# EAGLE design AA version (EAGLE 9.2.2)
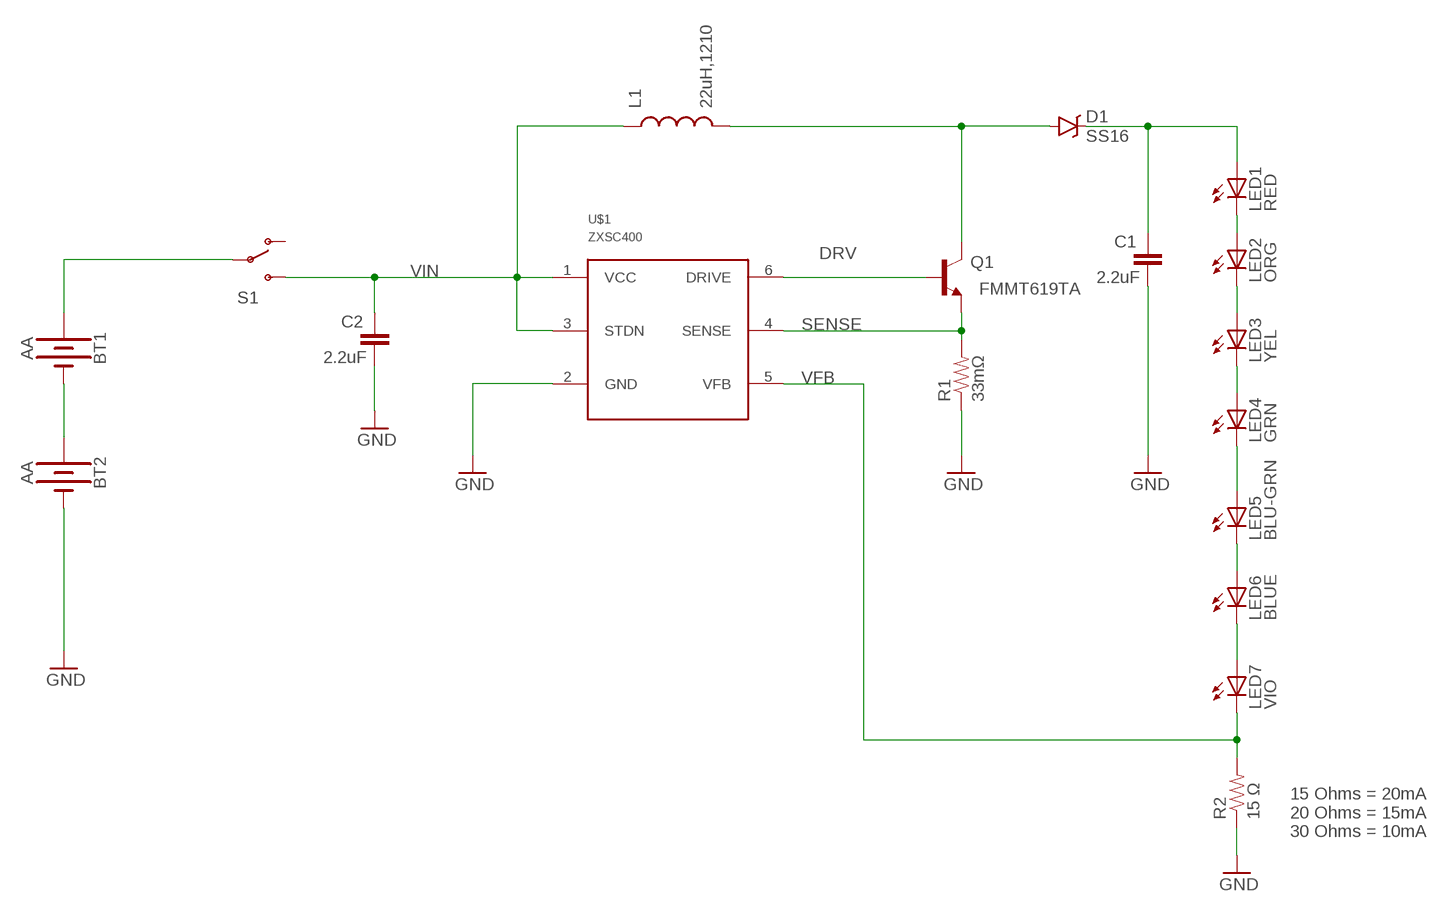
[diagram p0: schematic, sheet 1]

## Parts
BT1  AA  BATTERY-AA  [BATTERY-AA]
BT2  AA  BATTERY-AA  [BATTERY-AA]
C1  2.2uF  CAP1206  [1206]
C2  2.2uF  CAP1206  [1206]
D1  SS16  DIODE-SCHOTTKY-B340A  [SMA-DIODE]
L1  22uH,1210  INDUCTOR1210  [1210]
LED1  RED  LEDP-LCC-2  [P-LCC-2]
LED2  ORG  LEDP-LCC-2  [P-LCC-2]
LED3  YEL  LEDP-LCC-2  [P-LCC-2]
LED4  GRN  LEDP-LCC-2  [P-LCC-2]
LED5  BLU-GRN  LEDP-LCC-2  [P-LCC-2]
LED6  BLUE  LEDP-LCC-2  [P-LCC-2]
LED7  VIO  LEDP-LCC-2  [P-LCC-2]
Q1  FMMT619TA  TRANSISTOR_NPNSOT23-3  [SOT23-3]
R1  33mΩ  RESISTOR1206  [1206]
R2  15 Ω  RESISTOR1206  [1206]
S1  SWITCH-SPDTPTH_LOCK  [SWITCH-SPDT_LOCK.007S]
U$1  ZXSC400  [SOT23-6]

## Nets
DRV: Q1.1(B) U$1.6(DRIVE)
GND: BT2.GND@1(-) C1.1 C2.1 R1.1 R2.1 U$1.2(GND)
N$1: BT1.GND@1(-) BT2.PWR@1(+)
N$2: BT1.PWR@1(+) S1.2(P)
N$4: D1.A L1.2 Q1.3(C)
N$6: C1.2 D1.C LED1.A
N$8: LED1.C LED2.A
N$9: LED2.C LED3.A
N$10: LED3.C LED4.A
N$11: LED4.C LED5.A
N$12: LED5.C LED6.A
N$13: LED6.C LED7.A
SENSE: Q1.2(E) R1.2 U$1.4(SENSE)
VFB: LED7.C R2.2 U$1.5(VFB)
VIN: C2.2 L1.1 S1.3(S) U$1.1(VCC) U$1.3(STDN)
Unconnected: S1.1(O)

## Notes on the sheet
- 15 Ohms = 20mA
  20 Ohms = 15mA
  30 Ohms = 10mA

## Library data of the parts
BT1 BT2 = SparkFun-Batteries:BATTERY: Battery - Single Cell A variety of battery chemistries, sizes, and footprints. Device List: 20MM_PTH - Coin Cell Battery Holder - 20mm (PTH) <https://www.sparkfun.com/products/783> 6.8MM_PTH - Coin Cell Battery Holder - 6.8MM(SMD) <https://www.digikey.com/product-detail/en/seiko-instruments/MS621FE-FL11E/728-1057-ND/1889208?WT.srch=1&gclid=CNOQ5a6LzdQCFZS2wAodXCkE0g> 12MM_SMD - Coin Cell Battery Holder - 12mm (SMD) <https://www.sparkfun.com/products/10592> 12MM_PTH - Coin Cell Battery Holder - 12mm (PTH) <https://www.sparkfun.com/products/7948> 20MM_SMD - 20mm Coin Cell Battery Holder (SMD) (2 legs) Used on the Big Time Watch Kit <https://www.sparkfun.com/products/11734> 20MM_SMD_4LEGS - Coin Cell Battery Holder - 20mm (SMD) <https://www.sparkfun.com/products/11892> 20MM_SMD_4LEGS_OVERPASTE - Coin Cell Battery Holder - 20mm (SMD) <https://www.sparkfun.com/products/11892> (Over-paste on the legs) 24.5MM_PTH - Coin Cell Battery Holder - 24.5mm (PTH) <https://www.sparkfun.com/products/8863> 9V - 9V Battery Holder - PC Mount Used on the SparkFun SparkPunk Sound Kit <https://www.sparkfun.com/products/11177> and SparkFun SparkPunk Sequencer Kit <https://www.sparkfun.com/products/12707> 18650 - Battery Holder - 18650 (PTH) <https://www.sparkfun.com/products/13113> AA - Battery Holder - 1xAA (PTH) <https://www.sparkfun.com/products/7949> AAA - Battery Holder - 1xAAA (PTH) <https://www.sparkfun.com/products/12718> AA_KIT - Battery Holder - 1xAA (PTH) <https://www.sparkfun.com/products/7949> Special kit package - pads only have exposed copper on one side of the board. AAA_KIT - Battery Holder - 1xAAA (PTH) <https://www.sparkfun.com/products/12718> Special kit package - pads only have exposed copper on one side of the board.; PROD_ID: BATT-08316; SF_SKU: PRT-07949
C1 C2 = SparkFun-Passives:CAP: Capacitor Standard 0603 ceramic capacitor, and 0.1" leaded capacitor.
D1 = SparkFun-DiscreteSemi:DIODE-SCHOTTKY: Schottky diodes in SFE's production catalog BAT20J 1A 23V 0.62Vf RB751 120mA 40V 0.37Vf PMEG4005EJ 0.5A 40V 0.42Vf MBRA140 1A 40V 0.5Vf B340A 3A 40V SMA; PROD_ID: DIO-09886; VALUE: B340A
L1 = SparkFun-Passives:INDUCTOR: Inductors Basic Inductor/Choke - 0603 and 1206. Footprints are not proven and vary greatly between part numbers. SRN6045- 33uH, 20% 1.4A SDR0403-560KL - 56uH, 10%, 500mA RMS/740mA peak
LED1-LED7 = led:LED: LED OSRAM: - CHIPLED LG R971, LG N971, LY N971, LG Q971, LY Q971, LO R971, LY R971 LH N974, LH R974 LS Q976, LO Q976, LY Q976 LO Q996 - Hyper CHIPLED LW Q18S LB Q993, LB Q99A, LB R99A - SideLED LS A670, LO A670, LY A670, LG A670, LP A670 LB A673, LV A673, LT A673, LW A673 LH A674 LY A675 LS A676, LA A676, LO A676, LY A676, LW A676 LS A679, LY A679, LG A679 - Hyper Micro SIDELED® LS Y876, LA Y876, LO Y876, LY Y876 LT Y87S - SmartLED LW L88C, LW L88S LB L89C, LB L89S, LG L890 LS L89K, LO L89K, LY L89K LS L896, LA L896, LO L896, LY L896 - TOPLED LS T670, LO T670, LY T670, LG T670, LP T670 LSG T670, LSP T670, LSY T670, LOP T670, LYG T670 LG T671, LOG T671, LSG T671 LB T673, LV T673, LT T673, LW T673 LH T674 LS T676, LA T676, LO T676, LY T676, LB T676, LH T676, LSB T676, LW T676 LB T67C, LV T67C, LT T67C, LS T67K, LO T67K, LY T67K, LW E67C LS E67B, LA E67B, LO E67B, LY E67B, LB E67C, LV E67C, LT E67C LW T67C LS T679, LY T679, LG T679 LS T770, LO T770, LY T770, LG T770, LP T770 LB T773, LV T773, LT T773, LW T773 LH T774 LS E675, LA E675, LY E675, LS T675 LS T776, LA T776, LO T776, LY T776, LB T776 LHGB T686 LT T68C, LB T68C - Hyper Mini TOPLED® LB M676 - Mini TOPLED Santana® LG M470 LS M47K, LO M47K, LY M47K Source: http://www.osram.convergy.de LUXEON: - LUMILED® LXK2-PW12-R00, LXK2-PW12-S00, LXK2-PW14-U00, LXK2-PW14-V00 LXK2-PM12-R00, LXK2-PM12-S00, LXK2-PM14-U00 LXK2-PE12-Q00, LXK2-PE12-R00, LXK2-PE12-S00, LXK2-PE14-T00, LXK2-PE14-U00 LXK2-PB12-K00, LXK2-PB12-L00, LXK2-PB12-M00, LXK2-PB14-N00, LXK2-PB14-P00, LXK2-PB14-Q00 LXK2-PR12-L00, LXK2-PR12-M00, LXK2-PR14-Q00, LXK2-PR14-R00 LXK2-PD12-Q00, LXK2-PD12-R00, LXK2-PD12-S00 LXK2-PH12-R00, LXK2-PH12-S00 LXK2-PL12-P00, LXK2-PL12-Q00, LXK2-PL12-R00 Source: www.luxeon.com KINGBRIGHT: KA-3528ASYC Source: www.kingbright.com
Q1 = SparkFun-DiscreteSemi:TRANSISTOR_NPN: Generic NPN BJT MMBT2222A - TRANS-08049 (SOT-23, 1A 40V) MPSA42 - TRANS-09116 (SOT-23, 500mA 300V) MMBT5088LT1G - TRANS-11160 (SOT-23, 50 mA 30V) BC547 - COM-08928 <http://www.sparkfun.com/products/8928> (TO-92 45V 100mA) (1.Collector 2.Base 3.Emitter) 2N3904 - COM-00521 <http://www.sparkfun.com/products/521> (TO-92 40V 200mA) (1.Emitter 2.Base 3.Collector) P2N2222A - COM-12852 <http://www.sparkfun.com/products/12852> (TO-92 40V 600mA) (1.Collector 2.Base 3.Emitter)
R1 R2 = SparkFun-Passives:RESISTOR: Resistor Basic schematic elements and footprints for 0603, 1206, and PTH resistors.
S1 = SparkFun-Electromechanical:SWITCH-SPDT: SPDT Switch Simple slide switch, Spark Fun Electronics SKU : COM-00102 DPDT SMT slide switch, AYZ0202, SWCH-08179
U$1 = ZXSC400:ZXSC400

## Board
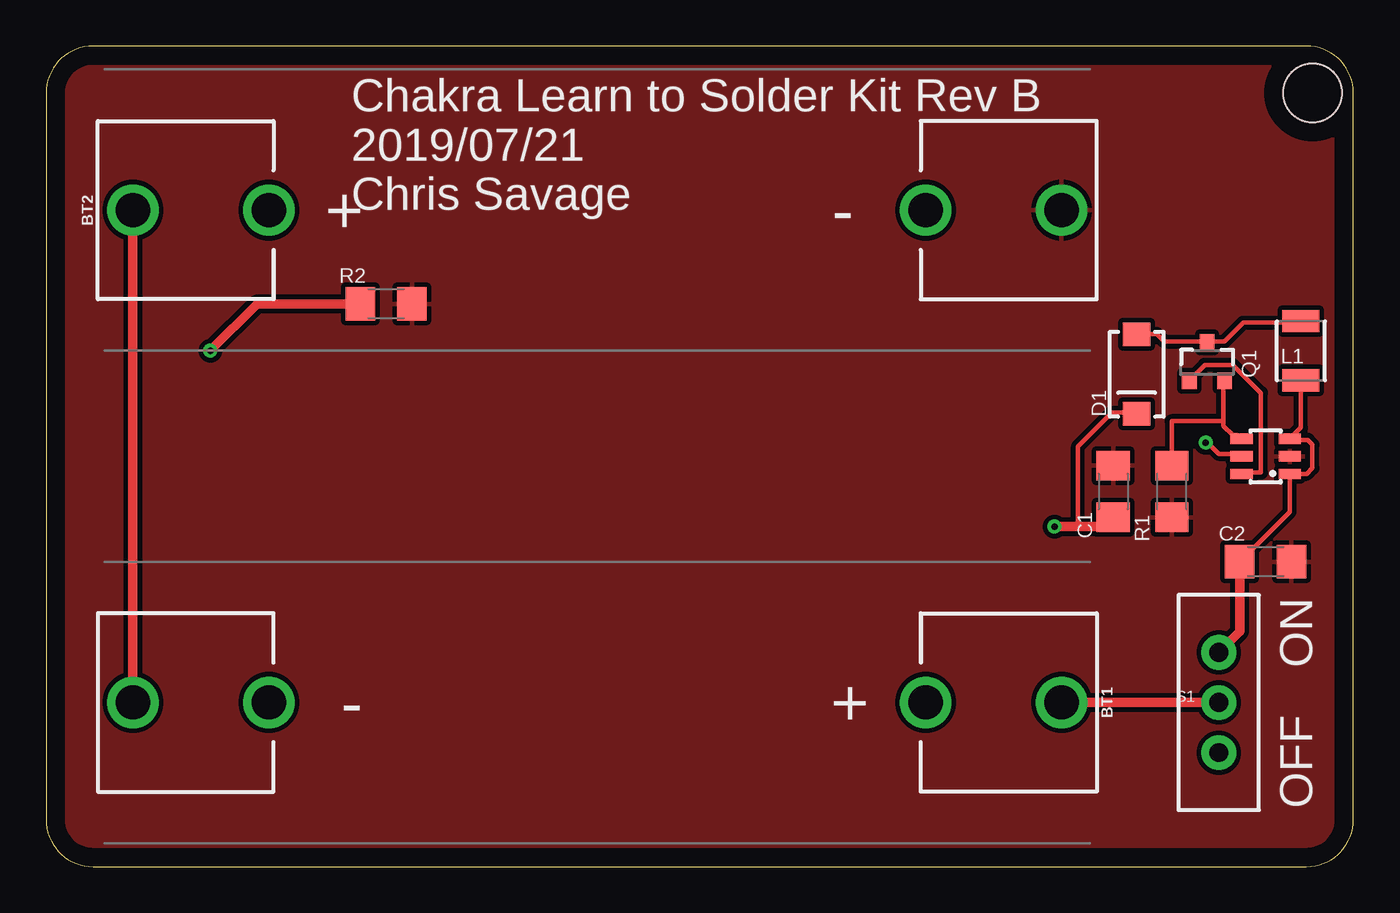
[diagram p1: board, top side]
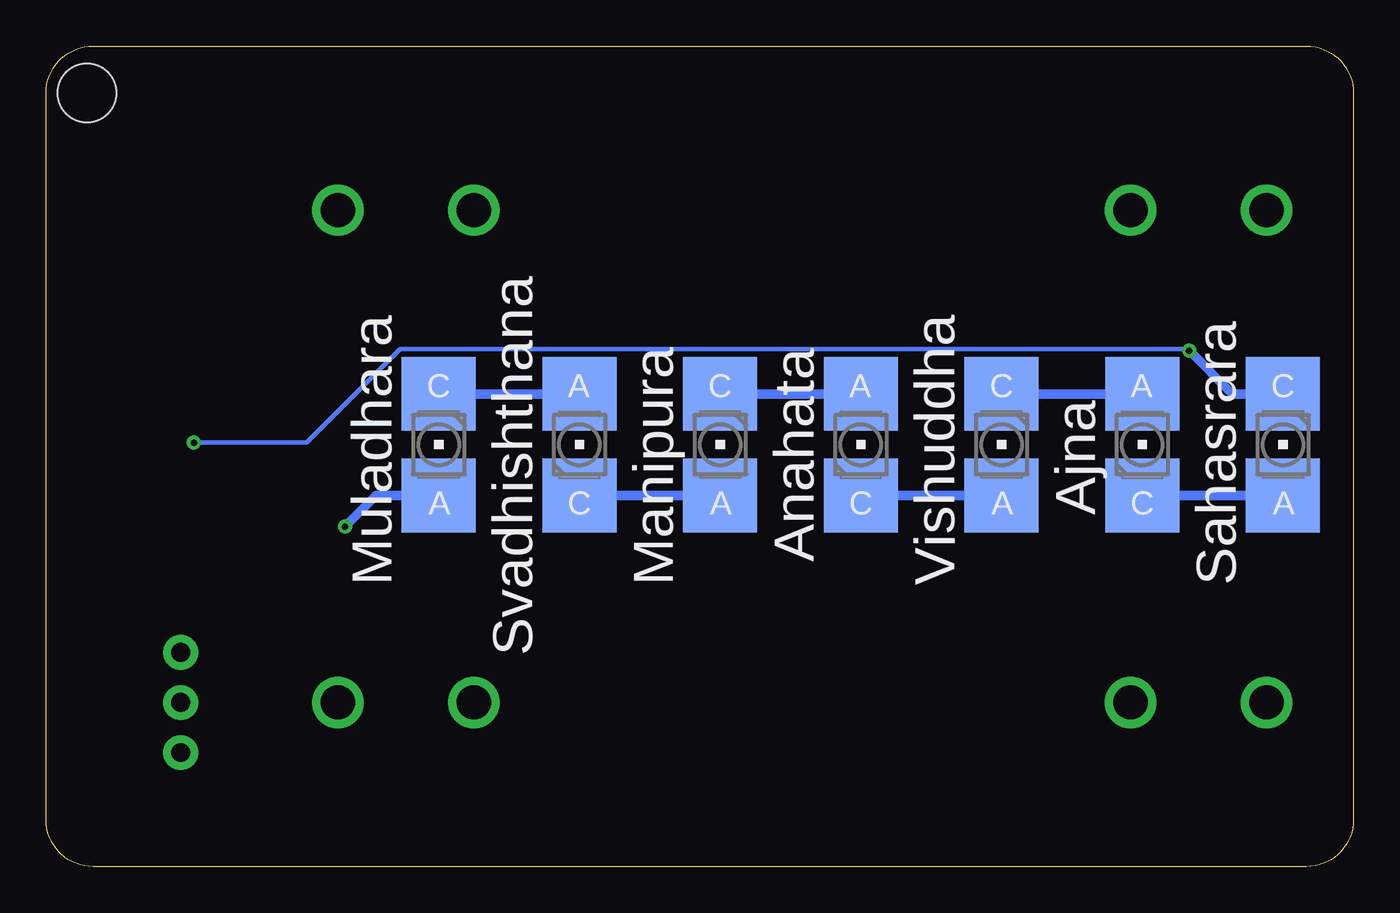
[diagram p2: board, bottom side, seen from below]

Size 70.79 x 44.44 mm. Coordinates in mm from the lower left corner, seen from the top.
Outline: 0,41.9 0,2.54 arc90 2.54,0 68.25,0 arc90 70.79,2.54 70.79,41.9 arc90 68.25,44.44 2.54,44.44 arc90 0,41.9
Copper layers (1*16): Top 0.035mm / dielectric 1.5mm / Bottom 0.035mm
Design rules "default": minimum track width 10mil, minimum drill 0.35mm, track to track 6mil, track to pad 6mil, pad to pad 6mil, via to via 6mil, smd to smd 6mil, copper to edge 40mil, drill to drill 6mil, minimum pad ring 10mil, minimum via ring 8mil, stop-mask expansion 4mil, vias tented up to drill 0mil, thermal gap 10mil
Holes 3.17 mm at 68.58,41.91

### Footprints (pad centres in the part's own frame; a part is rotated, then mirrored left to right if it is on the bottom)
BATTERY-AA = drill 1.854: GND@1 25.146,0; GND@2 17.78,0; PWR@1 -25.146,0; PWR@2 -17.78,0
1206 = smd 1.6 x 1.8: 1 -1.4,0; 2 1.4,0
SMA-DIODE = smd 1.27 x 1.47: A -2.15,0; C 2.15,0
1210 = smd 1.2 x 2: 1 -1.6,0; 2 1.6,0
P-LCC-2 = smd 4 x 4: A 0,2.75; C 0,-2.75
SOT23-3 = smd 0.8 x 0.9: 1 -0.95,-1; 2 0.95,-1; 3 0,1.1
SWITCH-SPDT_LOCK.007S = drill 1.016 pad 1.88: 1 0,2.718; 2 0,0; 3 0,-2.718
SOT23-6 = smd 0.55 x 1.2: 1 0.95,1.3; 2 0,1.3; 3 -0.95,1.3; 4 -0.95,-1.3; 5 0,-1.3; 6 0.95,-1.3

### Placement (x,y rotation side)
BT1  29.84,8.89 180 top
BT2  29.84,35.56 0 top
C1  57.79,20.32 270 top
C2  66.04,16.51 180 top
D1  59.05,26.67 270 top
L1  67.94,27.94 90 top
LED1  49.53,22.86 180 bottom
LED2  41.91,22.86 0 bottom
LED3  34.29,22.86 180 bottom
LED4  26.67,22.86 0 bottom
LED5  19.05,22.86 180 bottom
LED6  11.43,22.86 0 bottom
LED7  3.81,22.86 180 bottom
Q1  62.87,27.3 0 top
R1  60.96,20.32 90 top
R2  18.41,30.48 180 top
S1  63.5,8.89 180 top
U$1  66.04,22.23 270 top

### Tracks (layer width: path | path; a pad name or v marks a point on that pad's centre or on a via)
DRV
  Top 0.254: 61.98,26.21 Q1.1 61.98,26.42 62.74,27.18 64.26,27.18 65.79,25.65 65.79,21.34 64.77,21.34 U$1.6
GND
  pour Top (isolate 0.254): -0.63,46.35 73.03,46.35 73.03,-1.91 -0.63,-1.91
N$1
  Top 0.508: BT2.PWR@1 BT1.GND@1
N$2
  Top 0.508: BT1.PWR@1 S1.2
N$4
  Top 0.254: D1.A 59.13,28.85 60.15,28.85 60.55,28.45 62.79,28.45 Q1.3 62.99,28.45 63.8,28.45 64.82,29.46 67.87,29.46 L1.2
N$6  (via drill 0.35)
  Top 0.254: 55.88,18.41 55.88,22.76 57.71,24.59 58.93,24.59 D1.C
  Top 0.508: v54.61,18.41 55.88,18.41 57.28,18.41 C1.2
  Bottom 0.508: LED1.A 52.91,20.11 v54.61,18.41
N$8
  Bottom 0.508: LED2.A LED1.C
N$9
  Bottom 0.508: LED3.A 41.07,20.11 41.27,20.32 41.7,20.32 LED2.C
N$10
  Bottom 0.508: LED4.A LED3.C
N$11
  Bottom 0.508: LED5.A LED4.C
N$12
  Bottom 0.508: LED6.A LED5.C
N$13
  Bottom 0.508: LED7.A LED6.C
SENSE
  Top 0.254: 63.8,26.21 Q1.2 63.75,26.16 63.75,24.13 | 60.96,21.74 R1.2 60.96,24.13 63.75,24.13 | 63.75,24.13 63.75,23.88 64.26,23.37 64.52,23.37 U$1.4
VFB  (via drill 0.35)
  Top 0.254: U$1.5 64.52,22.35 63.5,22.35 62.99,22.86 v62.79,22.96
  Top 0.508: R2.2 11.43,30.48 v8.89,27.94
  Bottom 0.254: v62.79,22.96 56.69,22.96 51.61,28.04 8.99,28.04 v8.89,27.94
  Bottom 0.508: LED7.C 6.56,25.61 v8.89,27.94
VIN
  Top 0.254: 67.87,26.21 L1.1 67.94,23.78 U$1.3 67.4,23.11 68.33,23.11 68.58,22.86 68.58,21.59 68.27,21.27 U$1.1 67.34,19.21 C2.2 64.62,16.66
  Top 0.508: S1.3 64.64,12.75 C2.2

### Text on the board
tNames: Chakra Learn to Solder Kit Rev B / 2019/07/21 / Chris Savage | ON | OFF
bNames: Ajna | Anahata | Sahasrara | Vishuddha | Manipura | Muladhara | Svadhishthana